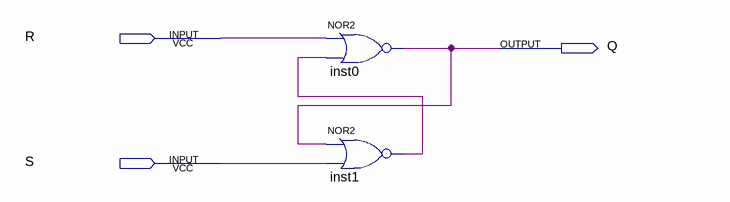
[diagram p0: schematic sheet]
// Quartus schematic AsynhronusRS.bdf as structural Verilog: 2 symbols, 3 pins
module AsynhronusRS (
  input  R,
  input  S,
  output Q
);

  wire inst1_out;

  nor inst0 (Q, R, inst1_out);
  nor inst1 (inst1_out, Q, S);
endmodule
